# Altium schematic sheet mcu.SchDoc: MCU
size A4 portrait; Author: wq; DrawnBy: wq; Organization: Fulei Electronic; Address1: 14a Yulan Rd; Address2: Hefei; Address3: Anhui Pro.; Address4: CHN; DocumentNumber: 1; Revision: betaV1.0; SheetNumber: 1; SheetTotal: 1
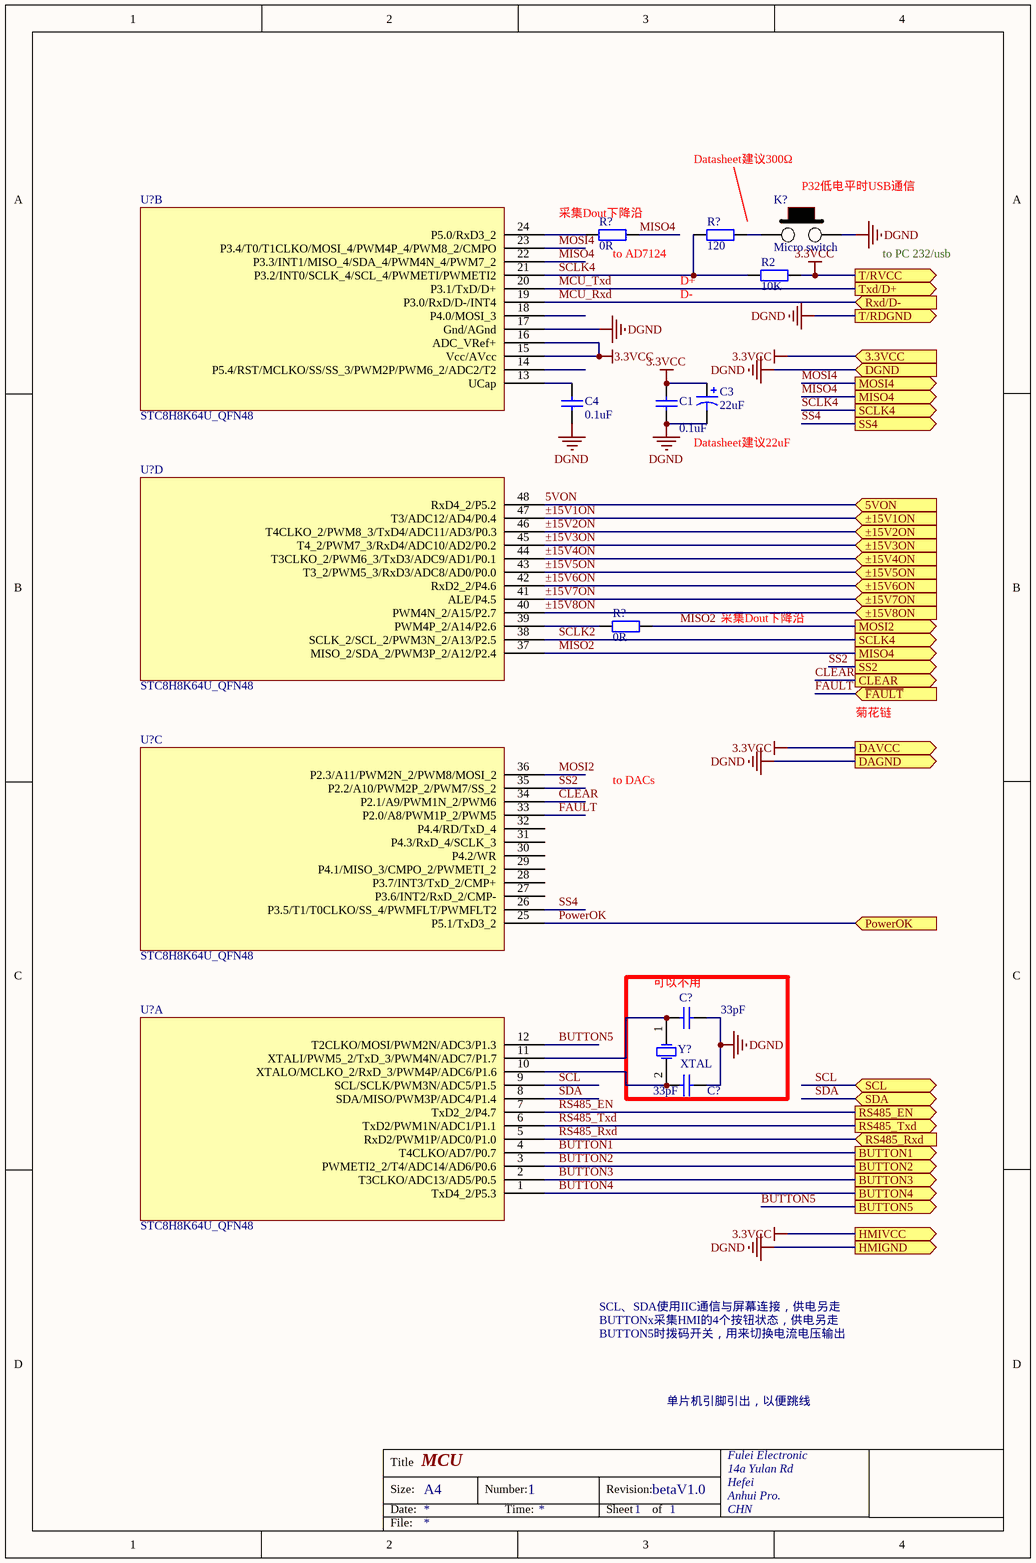
[diagram p0: mcu.SchDoc]

## Parts
(Parts that share a designator on the sheet are numbered #1, #2 ... from top to bottom, then left to right.)
C1  value 0.1uF  [0805c]  (hidden comment: CC0805MRX7R9BB104)
C3  value 22uF  [CB]  (hidden comment: T494B226M006AHAUTO)
C4  value 0.1uF  [0805c]  (hidden comment: CC0805MRX7R9BB104)
C?#1  value 33pF  [0805c]  (hidden comment: CC0805MRX7R9BB330)
C?#2  value 33pF  [0805c]  (hidden comment: CC0805MRX7R9BB330)
K?  Micro switch
R2  value 10K  [0805R]  (hidden comment: RC0805JR-0710KL)
R?#1  value 0R  [0805R]  (hidden comment: RC0805JR-000KL)
R?#2  value 120  [0805R]  (hidden comment: RC0805JR-07120RL)
R?#3  value 0R  [0805R]  (hidden comment: RC0805JR-000KL)
U?#1  STC8H8K64U_QFN48  [LQFP48]  (part B of 4)
U?#2  STC8H8K64U_QFN48  [LQFP48]  (part D of 4)
U?#3  STC8H8K64U_QFN48  [LQFP48]  (part C of 4)
U?#4  STC8H8K64U_QFN48  [LQFP48]  (part A of 4)
Y?  XTAL  [11.0592MHz]

## Blocks framed on the sheet
可以不用: C?#1 C?#2 Y?

## Ports
3.3VCC (in), 5VON (in), BUTTON1 (out), BUTTON2 (out), BUTTON3 (out), BUTTON4 (out), BUTTON5 (out), CLEAR (out), DAGND (out), DAVCC (out), DGND (in), HMIGND (out), HMIVCC (out), MISO4 (out), MOSI2 (out), MOSI4 (out), PowerOK (in), RS485_EN (out), RS485_Rxd (in), RS485_Txd (out), Rxd/D- (in), SCL (bidir), SCLK4 (out), SDA (bidir), SS2 (out), SS4 (out), T/RDGND (out), T/RVCC (out), Txd/D+ (out), ~{FAULT} (in), ±15V1ON (in), ±15V2ON (in), ±15V3ON (in), ±15V4ON (in), ±15V5ON (in), ±15V6ON (in), ±15V7ON (in), ±15V8ON (in)

## Nets
3.3VCC: C1.1 C3.1 R2.2 U?#1.15(Vcc/AVcc) U?#1.16(ADC_VRef+) ; port T/RVCC, port 3.3VCC, port DAVCC, port HMIVCC
DGND: C1.2 C3.2 C4.1 C?#1.2 C?#2.2 K?.2 U?#1.17(Gnd/AGnd) ; port T/RDGND, port DGND, port DAGND, port HMIGND
5VON: U?#2.48(RxD4_2/P5.2) ; port 5VON
BUTTON1: U?#4.4(T4CLKO/AD7/P0.7) ; port BUTTON1
BUTTON2: U?#4.3(PWMETI2_2/T4/ADC14/AD6/P0.6) ; port BUTTON2
BUTTON3: U?#4.2(T3CLKO/ADC13/AD5/P0.5) ; port BUTTON3
BUTTON4: U?#4.1(TxD4_2/P5.3) ; port BUTTON4
BUTTON5: U?#4.12(T2CLKO/MOSI/PWM2N/ADC3/P1.3) ; port BUTTON5
CLEAR: U?#3.34(P2.1/A9/PWM1N_2/PWM6) ; port CLEAR
FAULT: U?#3.33(P2.0/A8/PWM1P_2/PWM5) ; port ~{FAULT}
MCU_Rxd: U?#1.19(P3.0/RxD/D-/INT4) ; port Rxd/D-
MCU_Txd: U?#1.20(P3.1/TxD/D+) ; port Txd/D+
MISO2: R?#1.2 R?#3.2 U?#1.22(P3.3/INT1/MISO_4/SDA_4/PWM4N_4/PWM7_2) U?#2.37(MISO_2/SDA_2/PWM3P_2/A12/P2.4) ; port MISO4, port MOSI2  [also labelled MISO4]
MOSI2: U?#3.36(P2.3/A11/PWM2N_2/PWM8/MOSI_2)
MOSI4: U?#1.23(P3.4/T0/T1CLKO/MOSI_4/PWM4P_4/PWM8_2/CMPO) ; port MOSI4
PowerOK: U?#3.25(P5.1/TxD3_2) ; port PowerOK
RS485_EN: U?#4.7(TxD2_2/P4.7) ; port RS485_EN
RS485_Rxd: U?#4.5(RxD2/PWM1P/ADC0/P1.0) ; port RS485_Rxd
RS485_Txd: U?#4.6(TxD2/PWM1N/ADC1/P1.1) ; port RS485_Txd
SCL: U?#4.9(SCL/SCLK/PWM3N/ADC5/P1.5) ; port SCL
SCLK2: R2.1 R?#2.2 U?#1.21(P3.2/INT0/SCLK_4/SCL_4/PWMETI/PWMETI2) U?#2.38(SCLK_2/SCL_2/PWM3N_2/A13/P2.5) ; port SCLK4  [also labelled SCLK4]
SDA: U?#4.8(SDA/MISO/PWM3P/ADC4/P1.4) ; port SDA
SS2: U?#3.35(P2.2/A10/PWM2P_2/PWM7/SS_2) ; port SS2
SS4: U?#3.26(P3.5/T1/T0CLKO/SS_4/PWMFLT/PWMFLT2) ; port SS4
±15V1ON: U?#2.47(T3/ADC12/AD4/P0.4) ; port ±15V1ON
±15V2ON: U?#2.46(T4CLKO_2/PWM8_3/TxD4/ADC11/AD3/P0.3) ; port ±15V2ON
±15V3ON: U?#2.45(T4_2/PWM7_3/RxD4/ADC10/AD2/P0.2) ; port ±15V3ON
±15V4ON: U?#2.44(T3CLKO_2/PWM6_3/TxD3/ADC9/AD1/P0.1) ; port ±15V4ON
±15V5ON: U?#2.43(T3_2/PWM5_3/RxD3/ADC8/AD0/P0.0) ; port ±15V5ON
±15V6ON: U?#2.42(RxD2_2/P4.6) ; port ±15V6ON
±15V7ON: U?#2.41(ALE/P4.5) ; port ±15V7ON
±15V8ON: U?#2.40(PWM4N_2/A15/P2.7) ; port ±15V8ON
NetC4_2: C4.2 U?#1.13(UCap)
NetC?#1_1: C?#1.1 U?#4.11(XTALI/PWM5_2/TxD_3/PWM4N/ADC7/P1.7) Y?.1(OSC1)
NetC?#2_1: C?#2.1 U?#4.10(XTALO/MCLKO_2/RxD_3/PWM4P/ADC6/P1.6) Y?.2(OSC2)
NetK?_1: K?.1 R?#2.1
NetR?#1_1: R?#1.1 U?#1.24(P5.0/RxD3_2)
NetR?#3_1: R?#3.1 U?#2.39(PWM4P_2/A14/P2.6)

Not connected (* = marked no-connect by the designer): U?#1 14(P5.4/RST/MCLKO/SS/SS_3/PWM2P/PWM6_2/ADC2/T2) 18(P4.0/MOSI_3); U?#3 27(P3.6/INT2/RxD_2/CMP-) 28(P3.7/INT3/TxD_2/CMP+) 29(P4.1/MISO_3/CMPO_2/PWMETI_2) 30(P4.2/WR) 31(P4.3/RxD_4/SCLK_3) 32(P4.4/RD/TxD_4)

## Notes on the sheet
- Datasheet建议300Ω
- (near R?#1) 采集Dout下降沿
- (near K?) P32低电平时USB通信
- (near R?#1) to AD7124
- (near R?#2) D+
- D-
- to PC 232/usb
- Datasheet建议22uF
- 采集Dout下降沿
- 菊花链
- to DACs
- SCL、SDA使用IIC通信与屏幕连接，供电另走
- BUTTONx采集HMI的4个按钮状态，供电另走
- BUTTON5时拨码开关，用来切换电流电压输出
- 单片机引脚引出，以便跳线
- Title
- Size:
- Date:
- A4
- Number:
- Time:
- Revision:
- Sheet
- of
- File:

## Library data of the parts
C1 C4 C?#1 C?#2 = Cap: Capacitor
  C?#1 C?#2: Published: 8-Jun-2000; LatestRevisionDate: 17-Jul-2002; LatestRevisionNote: Re-released for DXP Platform.; PackageReference: RAD-0.3; Publisher: Altium Limited; PackageDescription: Radial Cap, Thru-Hole; 2 Leads; 0.3 in Pin Spacing
C3 = Cap Pol1: Polarized Capacitor (Radial); Published: 8-Jun-2000; LatestRevisionDate: 17-Jul-2002; LatestRevisionNote: Re-released for DXP Platform.; PackageReference: RB7.6-15; Publisher: Altium Limited; PackageDescription: Polarized Capacitor (Radial); 2 Leads
R2 R?#1-R?#3 = Res2: Resistor; Published: 8-Jun-2000; LatestRevisionDate: 17-Jul-2002; LatestRevisionNote: Re-released for DXP Platform.; PackageReference: AXIAL-0.4; Publisher: Altium Limited; PackageDescription: Axial Device, Thru-Hole; 2 Leads; 0.4 in Pin Spacing
Y? = XTAL: Crystal Oscillator; Published: 8-Jun-2000; LatestRevisionDate: 17-Jul-2002; LatestRevisionNote: Re-released for DXP Platform.; PackageReference: R38; Publisher: Altium Limited; PackageDescription: Crystal, Thru-Hole; 2 Leads; Body 3.1 x 8.2 mm (Dia.xH)